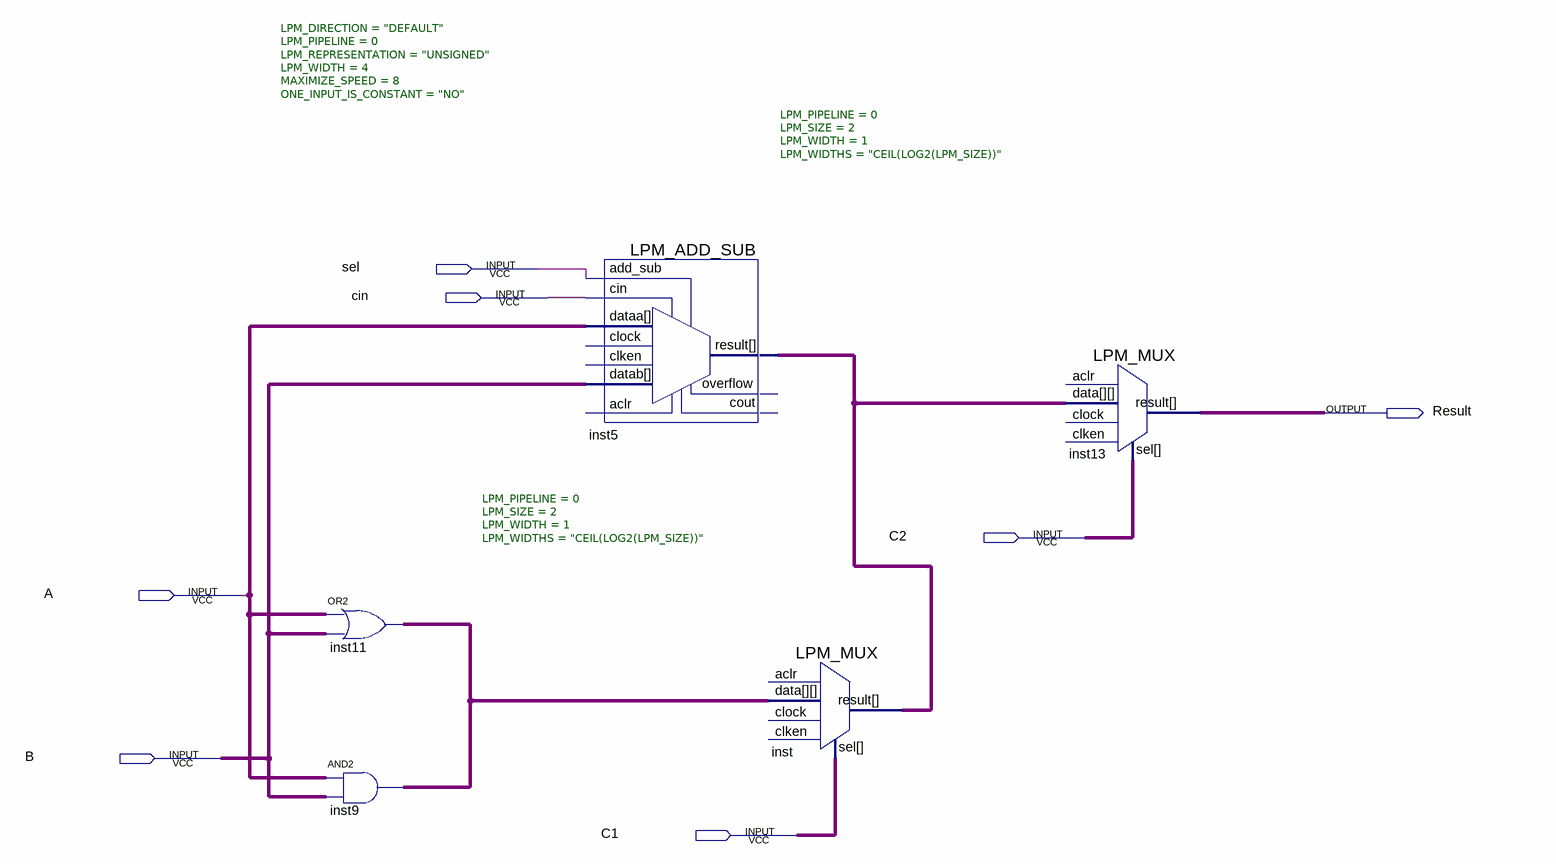
[diagram p0: schematic sheet]
// Quartus schematic project1.bdf as structural Verilog: 5 symbols, 7 pins
module project1 (
  input  sel,
  input  cin,
  input  C2,
  input  A,
  input  B,
  input  C1,
  output Result
);

  wire [3:0] inst5_result, inst11_out, undriven, undriven_2;

  assign inst11_out = undriven | undriven_2;  // OR2 inst11, 4 bits wide
  assign inst11_out = undriven & undriven_2;  // AND2 inst9, 4 bits wide
  LPM_ADD_SUB #(.LPM_DIRECTION("DEFAULT"), .LPM_PIPELINE(0), .LPM_REPRESENTATION("UNSIGNED"), .LPM_WIDTH(4), .MAXIMIZE_SPEED(8), .ONE_INPUT_IS_CONSTANT("NO")) inst5 (
    .datab(undriven_2), .add_sub(sel), .dataa(undriven), .cin(cin), .result(inst5_result));  // open: aclr, clock, clken, cout, overflow
  LPM_MUX #(.LPM_PIPELINE(0), .LPM_SIZE(2), .LPM_WIDTH(1), .LPM_WIDTHS("CEIL(LOG2(LPM_SIZE))")) inst (
    .data(inst11_out), .sel(C1), .result(inst5_result));  // open: clock, aclr, clken
  LPM_MUX #(.LPM_PIPELINE(0), .LPM_SIZE(2), .LPM_WIDTH(1), .LPM_WIDTHS("CEIL(LOG2(LPM_SIZE))")) inst13 (
    .data(inst5_result), .sel(C2), .result(Result));  // open: clock, aclr, clken
endmodule
